# Altium schematic sheet P11 CMOS SENSOR.SchDoc
size 297 x 209 mm
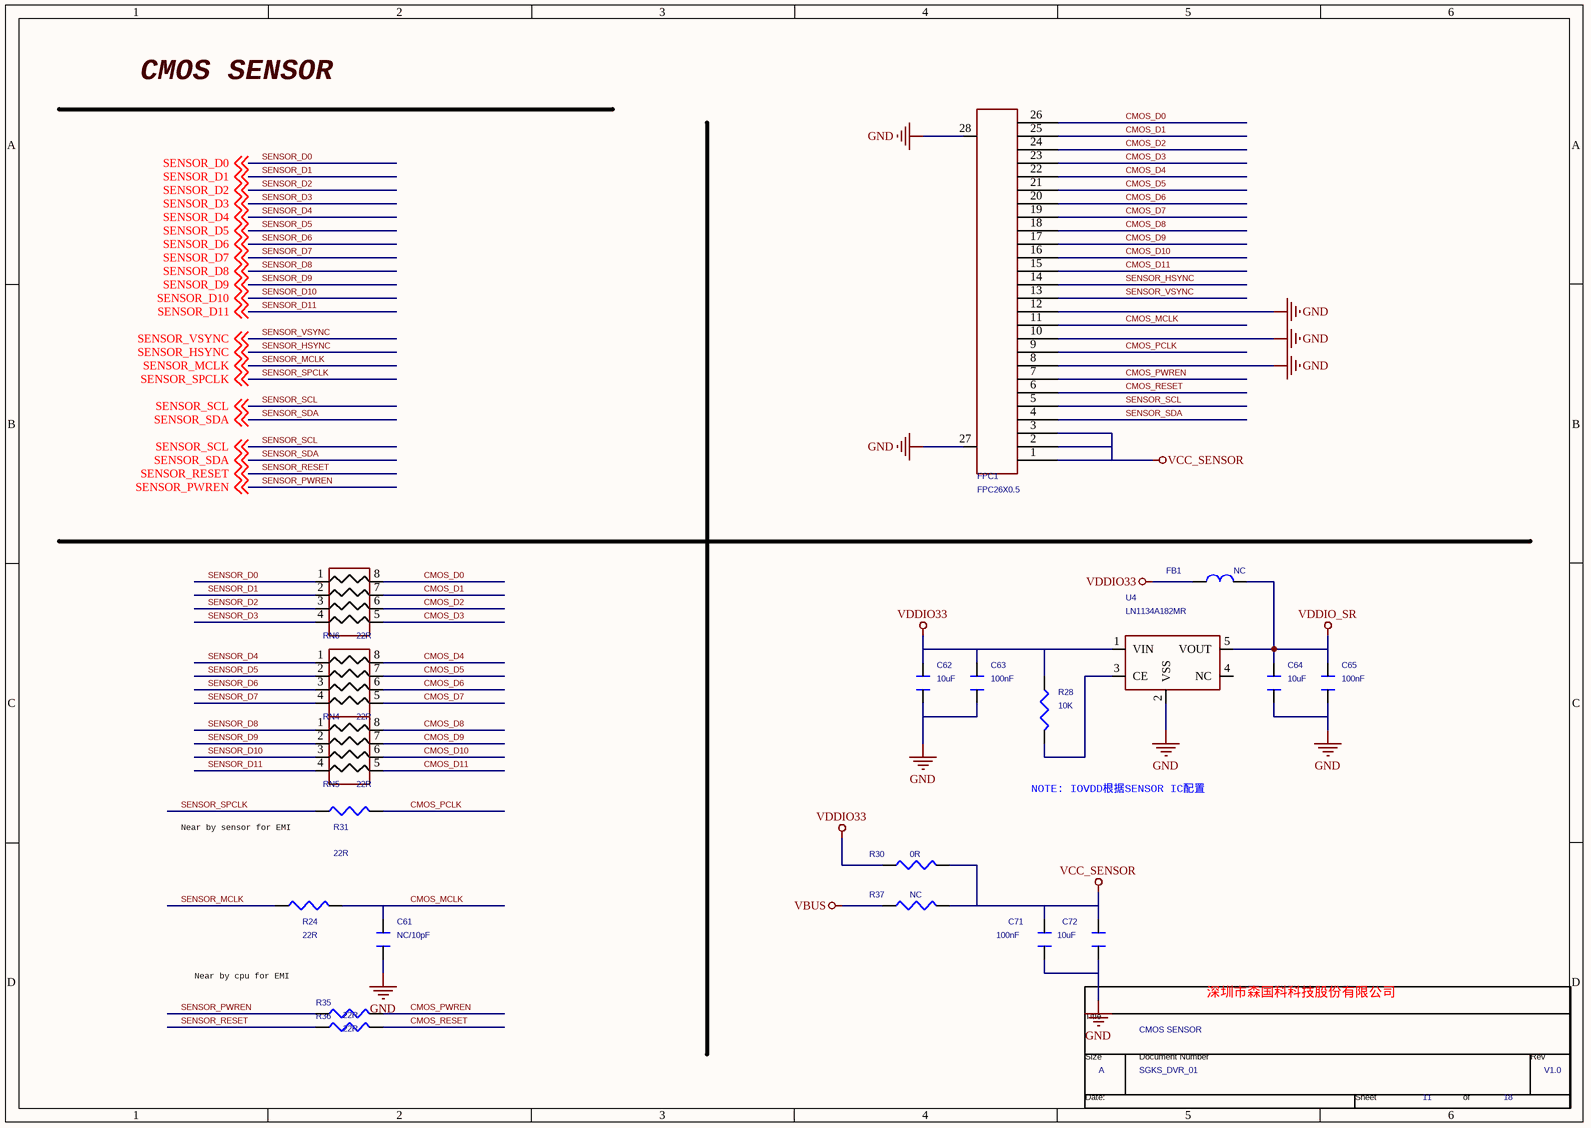
[diagram p0: P11 CMOS SENSOR.SchDoc]

## Parts
*  Page Count: 18  Page Number: 11  Page Size: A  Title: CMOS SENSOR  RevCode: V1.0  Doc: SGKS_DVR_01  (hidden comment: TitleBlock0)  (graphical)
C61  NC/10pF  [C0402]
C62  10uF  [C0603]
C63  100nF  [C0402]
C64  10uF  [C0603]
C65  100nF  [C0402]
C71  100nF  [C0402]
C72  10uF  [C0603]
FB1  NC  [0805]
FPC1  FPC26X0.5  [FPC_26PIN]
R24  22R  [R0603/SMD]
R28  10K  [R0603/SMD]
R30  0R  [R0603/SMD]
R31  22R  [R0603/SMD]
R35  22R  [R0603/SMD]
R36  22R  [R0603/SMD]
R37  NC  [R0603/SMD]
RN4  22R  [0402-8P4R]
RN5  22R  [0402-8P4R]
RN6  22R  [0402-8P4R]
U4  LN1134A182MR  [SOT23-6]

## Nets
GND: C61.1 C62.1 C63.1 C64.1 C65.1 C71.1 C72.1 FPC1.8 FPC1.10 FPC1.12 FPC1.27 FPC1.28 U4.2(VSS)
VBUS: R37.1
VCC_SENSOR: C71.2 C72.2 FPC1.1 FPC1.2 FPC1.3 R30.2 R37.2
VDDIO33: C62.2 C63.2 FB1.1 R28.1 R30.1 U4.1(VIN)
VDDIO_SR: C64.2 C65.2 FB1.2 U4.5(VOUT)
CMOS_D0: FPC1.26 RN6.8
CMOS_D1: FPC1.25 RN6.7
CMOS_D2: FPC1.24 RN6.6
CMOS_D3: FPC1.23 RN6.5
CMOS_D4: FPC1.22 RN4.8
CMOS_D5: FPC1.21 RN4.7
CMOS_D6: FPC1.20 RN4.6
CMOS_D7: FPC1.19 RN4.5
CMOS_D8: FPC1.18 RN5.8
CMOS_D9: FPC1.17 RN5.7
CMOS_D10: FPC1.16 RN5.6
CMOS_D11: FPC1.15 RN5.5
CMOS_MCLK: C61.2 FPC1.11 R24.2
CMOS_PCLK: FPC1.9 R31.1
CMOS_PWREN: FPC1.7 R35.1
CMOS_RESET: FPC1.6 R36.1
SENSOR_D0: RN6.1 ; off-sheet SENSOR_D0
SENSOR_D1: RN6.2 ; off-sheet SENSOR_D1
SENSOR_D2: RN6.3 ; off-sheet SENSOR_D2
SENSOR_D3: RN6.4 ; off-sheet SENSOR_D3
SENSOR_D4: RN4.1 ; off-sheet SENSOR_D4
SENSOR_D5: RN4.2 ; off-sheet SENSOR_D5
SENSOR_D6: RN4.3 ; off-sheet SENSOR_D6
SENSOR_D7: RN4.4 ; off-sheet SENSOR_D7
SENSOR_D8: RN5.1 ; off-sheet SENSOR_D8
SENSOR_D9: RN5.2 ; off-sheet SENSOR_D9
SENSOR_D10: RN5.3 ; off-sheet SENSOR_D10
SENSOR_D11: RN5.4 ; off-sheet SENSOR_D11
SENSOR_HSYNC: FPC1.14 ; off-sheet SENSOR_HSYNC
SENSOR_MCLK: R24.1 ; off-sheet SENSOR_MCLK
SENSOR_PWREN: R35.2 ; off-sheet SENSOR_PWREN
SENSOR_RESET: R36.2 ; off-sheet SENSOR_RESET
SENSOR_SCL: FPC1.5 ; off-sheet SENSOR_SCL
SENSOR_SDA: FPC1.4 ; off-sheet SENSOR_SDA
SENSOR_SPCLK: R31.2 ; off-sheet SENSOR_SPCLK
SENSOR_VSYNC: FPC1.13 ; off-sheet SENSOR_VSYNC
NetR28_2: R28.2 U4.3(CE)

Not connected (* = marked no-connect by the designer): U4 4(NC)

## Notes on the sheet
- CMOS SENSOR
- NOTE: IOVDD根据SENSOR IC配置
- Near by sensor for EMI
- Near by cpu for EMI
- 深圳市森国科科技股份有限公司
- (in symbol TitleBlock0) Title; Size; Document Number; Rev; Date:; Sheet; of

## Library data of the parts
C61-C65 C71 C72 = CAPACITOR: PAGE: 1
FB1 = Ferrite BEAD
FPC1 = CON40_2
R24 R31 R35 R36 = RES/SMD_0: Part Description: Chip Resistor
R28 R30 R37 = RES/SMD_1: Part Description: Chip Resistor; Type: 贴片电阻
RN4-RN6 = 742C083/SM_0: Page: 10
U4 = RT9266PE_0
* = TitleBlock0: Page Create Date: March  8, 1995